# EAGLE design PCBSPI (EAGLE 9.5.1)
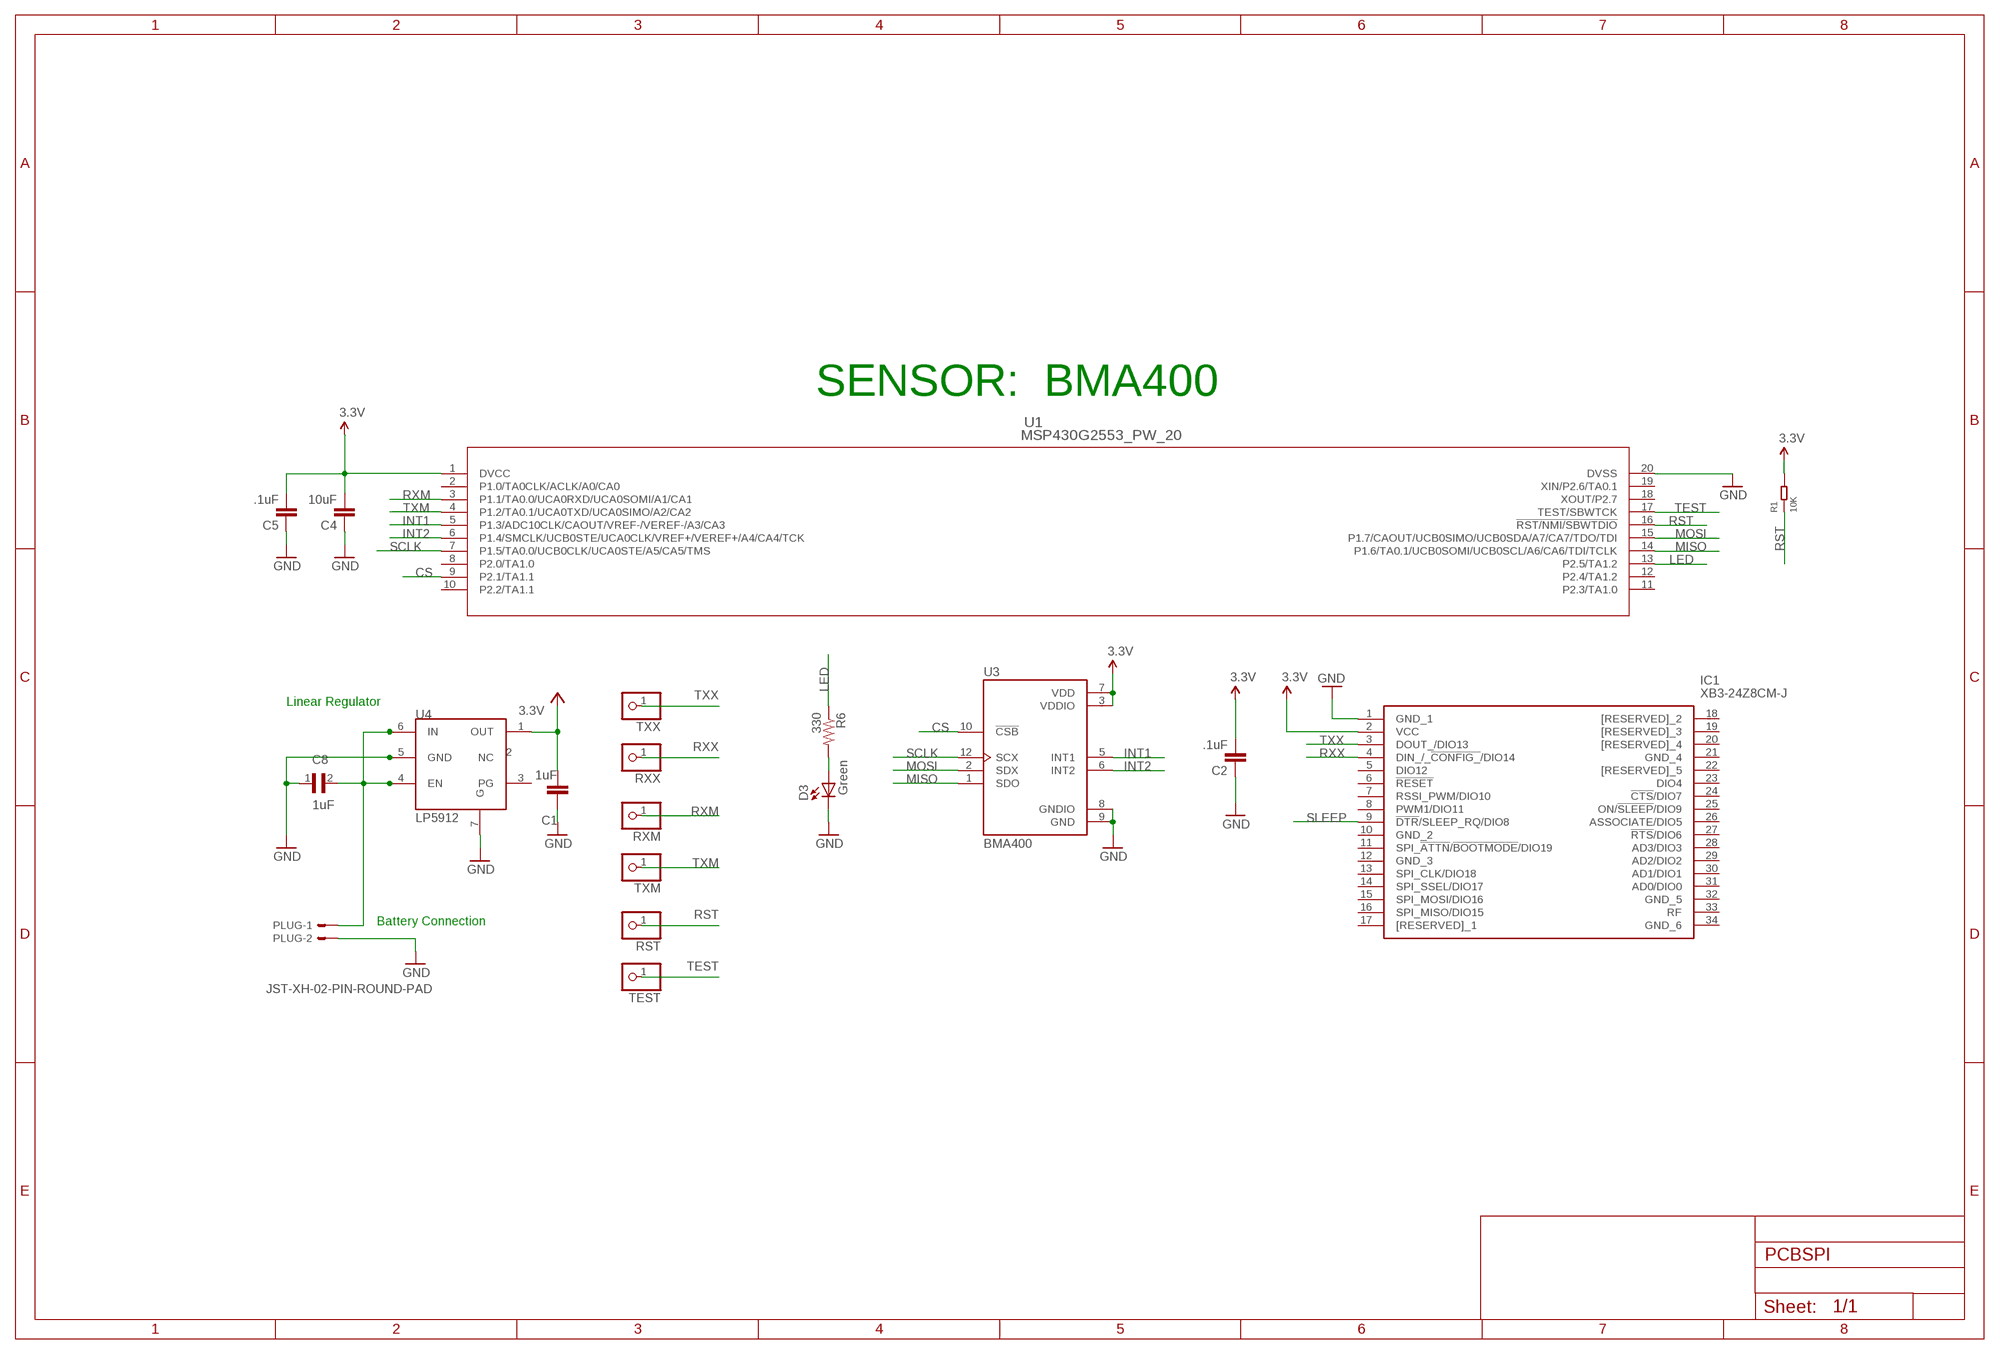
[diagram p0: schematic, sheet 1]

## Parts
C1  1uF  C-EUC0603  [C0603]
C2  .1uF  0.1UF-25V(+80/-20%)(0603)  [0603-CAP]
C4  10uF  0.1UF-25V(+80/-20%)(0603)  [0603-CAP]
C5  .1uF  0.1UF-25V(+80/-20%)(0603)  [0603-CAP]
C8  1uF  0402YD105MAT2A  [CAPC1005X71N]
D3  Green  LED  [0603-LED-ALT1]
IC1  XB3-24Z8CM-J  [XB324Z8CMJ]
PLUG  JST-XH-02-PIN-ROUND-PAD  [JST-XH-02-PACKAGE-ROUND-PAD]
R1  10K  SMD-RES-4.7K-5%-1/16W(0402)  [R0402]
R6  330  RESISTOR0603-RES  [0603-RES]
RST  PINHD-1X1  [1X01]
RXM  PINHD-1X1  [1X01]
RXX  PINHD-1X1  [1X01]
TEST  PINHD-1X1  [1X01]
TXM  PINHD-1X1  [1X01]
TXX  PINHD-1X1  [1X01]
U1  MSP430G2553_PW_20  [PW20]
U3  BMA400  [XDCR_BMA400]
U4  LP5912  [LP5912]

## Nets
3.3V: C2.2 C4.2 C5.2 IC1.2(VCC) R1.2 U1.1(DVCC) U3.3(VDDIO) U3.7(VDD)
BATTERY: C8.2 PLUG.1 U4.4(EN) U4.6(IN)
CS: U1.9(P2.1/TA1.1) U3.10(!CSB)
GND [vcc]: C1.1 C2.1 C4.1 C5.1 C8.1 D3.C IC1.1(GND_1) PLUG.2 U1.20(DVSS) U3.8(GNDIO) U3.9(GND) U4.5(GND) U4.7(G)
INT1: U1.5(P1.3/ADC10CLK/CAOUT/VREF-/VEREF-/A3/CA3) U3.5(INT1)
INT2: U1.6(P1.4/SMCLK/UCB0STE/UCA0CLK/VREF+/VEREF+/A4/CA4/TCK) U3.6(INT2)
LED: R6.1 U1.13(P2.5/TA1.2)
MISO: U1.14(P1.6/TA0.1/UCB0SOMI/UCB0SCL/A6/CA6/TDI/TCLK) U3.1(SDO)
MOSI: U1.15(P1.7/CAOUT/UCB0SIMO/UCB0SDA/A7/CA7/TDO/TDI) U3.2(SDX)
N$7: D3.A R6.2
RST: R1.1 RST.1 U1.16(!RST/NMI/SBWTDIO)
RXM: RXM.1 U1.3(P1.1/TA0.0/UCA0RXD/UCA0SOMI/A1/CA1)
RXX: IC1.4(DIN_/_!CONFIG_!/DIO14) RXX.1
SCLK: U1.7(P1.5/TA0.0/UCB0CLK/UCA0STE/A5/CA5/TMS) U3.12(SCX)
SLEEP: IC1.9(!DTR!/SLEEP_RQ/DIO8)
TEST: TEST.1 U1.17(TEST/SBWTCK)
TXM: TXM.1 U1.4(P1.2/TA0.1/UCA0TXD/UCA0SIMO/A2/CA2)
TXX: IC1.3(DOUT_/DIO13) TXX.1
VCC: C1.2 U4.1(OUT) ; supply symbol labelled 3.3V
Unconnected: IC1.5(DIO12) IC1.6(!RESET) IC1.7(RSSI_PWM/DIO10) IC1.8(PWM1/DIO11) IC1.10(GND_2) IC1.11(SPI_!ATTN!/!BOOTMODE!/DIO19) IC1.12(GND_3) IC1.13(SPI_CLK/DIO18) IC1.14(SPI_SSEL/DIO17) IC1.15(SPI_MOSI/DIO16) IC1.16(SPI_MISO/DIO15) IC1.17([RESERVED]_1) IC1.18([RESERVED]_2) IC1.19([RESERVED]_3) IC1.20([RESERVED]_4) IC1.21(GND_4) IC1.22([RESERVED]_5) IC1.23(DIO4) IC1.24(!CTS!/DIO7) IC1.25(ON/!SLEEP!/DIO9) IC1.26(ASSOCIATE/DIO5) IC1.27(!RTS!/DIO6) IC1.28(AD3/DIO3) IC1.29(AD2/DIO2) IC1.30(AD1/DIO1) IC1.31(AD0/DIO0) IC1.32(GND_5) IC1.33(RF) IC1.34(GND_6) U1.2(P1.0/TA0CLK/ACLK/A0/CA0) U1.8(P2.0/TA1.0) U1.10(P2.2/TA1.1) U1.11(P2.3/TA1.0) U1.12(P2.4/TA1.2) U1.18(XOUT/P2.7) U1.19(XIN/P2.6/TA0.1) U4.2(NC) U4.3(PG)

## Notes on the sheet
- SENSOR:  BMA400
- Linear Regulator
- Battery Connection

## Library data of the parts
C1 = rcl:C-EU: CAPACITOR, European symbol; SPICEPREFIX: C
C2 C4 C5 = SparkFun-Capacitors:0.1UF-25V(+80/-20%)(0603): CAP-00810 Ceramic Standard decoupling cap; PROD_ID: CAP-00810; VALUE: 0.1uF
C8 = Capacitor1uF:0402YD105MAT2A: CAP 1UF 16VDC X5R 20% SMD 0402; AVAILABILITY: Unavailable; DESCRIPTION: Cap 1uf 16vdc X5r 20% Smd 0402; MF: AVX; MP: 0402YD105MAT2A; PACKAGE: 1005 AVX; PRICE: None
D3 = Testing:LED: LEDs Standard schematic elements and footprints for 5mm, 3mm, 1206, and 0603 sized LEDs. 5mm - Spark Fun Electronics SKU : COM-00529 (and others)
IC1 = XB3-24Z8CM-J:XB3-24Z8CM-J: Zigbee Modules (802.15.4) XBee3 ,2.4 Ghz ZB 3.0, Chip Ant, MMT Source: Datasheet <https://www.digi.com/resources/documentation/digidocs/pdfs/90001543.pdf>; DESCRIPTION: Zigbee Modules (802.15.4) XBee3 ,2.4 Ghz ZB 3.0, Chip Ant, MMT; HEIGHT: 4mm; MANUFACTURER_NAME: Digi International; MANUFACTURER_PART_NUMBER: XB3-24Z8CM-J; MOUSER_PART_NUMBER: 888-XB3-24Z8CM-J; MOUSER_PRICE-STOCK: https://www.mouser.com/Search/Refine.aspx?Keyword=888-XB3-24Z8CM-J
PLUG = Rembrandt Electronics - JST XH Connectors v1-0:JST-XH-02-PIN: JST XH Connector 2 Pin Wire to board connector. Pitch: 2,54 mm, (0.100") Number of pins: 2 Created by Rembrandt Electronics www.rembrandtelectronics.com
R1 = RES-4.7K-SMD-5_-1_16W_0402_:SMD-RES-4.7K-5%-1/16W(0402): 301010010; AVAILABILITY: Unavailable; DESCRIPTION: Res Thick Film 0402 4.7K Ohm 5% 0.063W_1/16W_ ?100ppm/C Molded SMD Paper T/R; MF: Yageo; MP: RC0402JR074K7L; PACKAGE: 0402 Yageo; PRICE: None
R6 = SparkFun:RESISTOR: Resistor Basic schematic elements and footprints for 0603, 1206, and PTH resistors.
RST RXM RXX TEST TXM TXX = pinhead:PINHD-1X1: PIN HEADER
U1 = MSP430G2553_PW_20:MSP430G2553_PW_20; BUILT_BY: EMA_UL_Team; MANUFACTURER: Texas Instruments; MANUFACTURER_PART_NUMBER: MSP430G2553_PW_20; VENDOR: Texas Instruments
U3 = BMA400:BMA400: Ultra low power, 12-bit digital triaxial accelerometer; AVAILABILITY: Unavailable; DESCRIPTION: Accelerometer X, Y, Z Axis ±2g, 4g, 8g, 16g 12-LGA _2x2_; MF: Bosch Sensortec; MP: BMA400; PACKAGE: LGA-12 Bosch Tools; PRICE: None
U4 = electronic-labs:LP5912

## Net classes
0 default: width 0.203 mm
1 vcc: width 0.254 mm

## Board
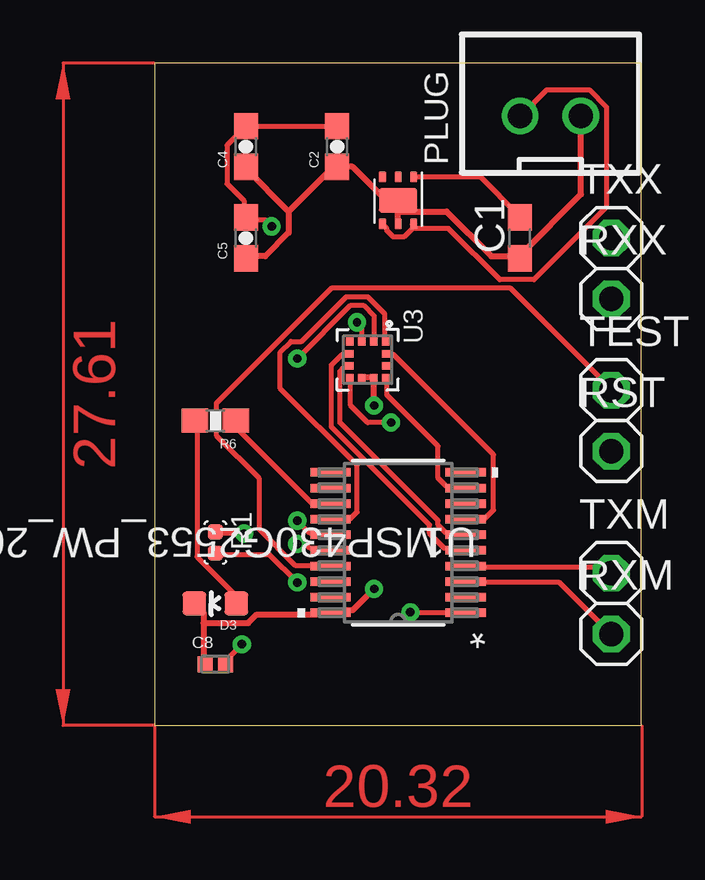
[diagram p1: board, top side]
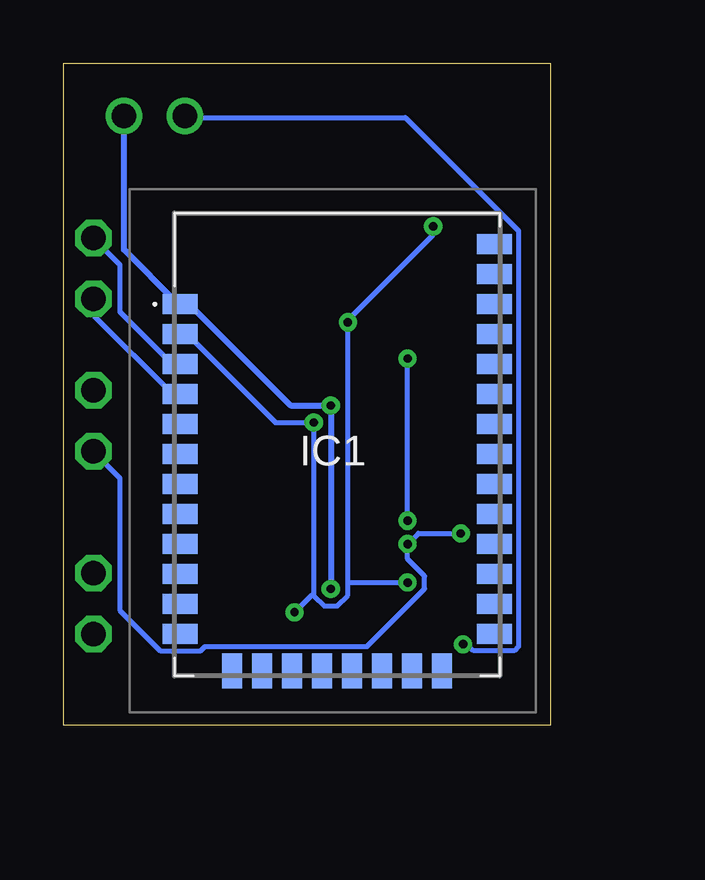
[diagram p2: board, bottom side, seen from below]

Size 20.3 x 27.61 mm. Coordinates in mm from the lower left corner, seen from the top.
Outline: 0,0 20.3,0 20.3,27.61 0,27.61 0,0
Copper layers (1*16): Top 0.035mm / dielectric 1.5mm / Bottom 0.035mm
Design rules "default": minimum track width 6mil, minimum drill 0.35mm, track to track 6mil, track to pad 6mil, pad to pad 6mil, via to via 6mil, smd to smd 6mil, copper to edge 40mil, drill to drill 6mil, minimum pad ring 10mil, minimum via ring 8mil, stop-mask expansion 4mil, vias tented up to drill 0mil, thermal gap 10mil

### Footprints (pad centres in the part's own frame; a part is rotated, then mirrored left to right if it is on the bottom)
C0603 = smd 1.1 x 1: 1 -0.85,0; 2 0.85,0
0603-CAP = smd 1.1 x 1: 1 -0.85,0; 2 0.85,0
CAPC1005X71N = smd 0.62 x 0.67: 1 -0.425,0; 2 0.425,0
0603-LED-ALT1 = smd 1 x 1: A 0,-0.877; C 0,0.877
XB324Z8CMJ = smd 1.448 x 0.838: 1 -6.553,13.75; 2 -6.553,12.5; 3 -6.553,11.25; 4 -6.553,10; 5 -6.553,8.75; 6 -6.553,7.5; 7 -6.553,6.25; 8 -6.553,5; 9 -6.553,3.75; 10 -6.553,2.5; 11 -6.553,1.25; 12 -6.553,0; 21 6.553,0; 22 6.553,1.25; 23 6.553,2.5; 24 6.553,3.75; 25 6.553,5; 26 6.553,6.25; 27 6.553,7.5; 28 6.553,8.75; 29 6.553,10; 30 6.553,11.25; 31 6.553,12.5; 32 6.553,13.75; 33 6.553,15; 34 6.553,16.25 | smd 0.838 x 1.448: 13 -4.375,-1.537; 14 -3.125,-1.537; 15 -1.875,-1.537; 16 -0.625,-1.537; 17 0.625,-1.537; 18 1.875,-1.537; 19 3.125,-1.537; 20 4.375,-1.537
JST-XH-02-PACKAGE-ROUND-PAD = drill 1.016: 1 -1.27,0; 2 1.27,0
R0402 = smd 0.635 x 0.635: 1 0,0.445; 2 0,-0.445
0603-RES = smd 1.1 x 1: 1 -0.85,0; 2 0.85,0
1X01 = drill 1.016 octagon: 1 0,0
PW20 = smd 1.676 x 0.356: 1 -2.819,2.925; 2 -2.819,2.275; 3 -2.819,1.625; 4 -2.819,0.975; 5 -2.819,0.325; 6 -2.819,-0.325; 7 -2.819,-0.975; 8 -2.819,-1.625; 9 -2.819,-2.275; 10 -2.819,-2.925; 11 2.819,-2.925; 12 2.819,-2.275; 13 2.819,-1.625; 14 2.819,-0.975; 15 2.819,-0.325; 16 2.819,0.325; 17 2.819,0.975; 18 2.819,1.625; 19 2.819,2.275; 20 2.819,2.925
XDCR_BMA400 = smd 0.35 x 0.3: 1 -0.775,0.75; 2 -0.775,0.25; 3 -0.775,-0.25; 4 -0.775,-0.75; 7 0.775,-0.75; 8 0.775,-0.25; 9 0.775,0.25; 10 0.775,0.75 | smd 0.3 x 0.35: 5 -0.25,-0.775; 6 0.25,-0.775; 11 0.25,0.775; 12 -0.25,0.775
LP5912 = smd 0.45 x 0.3: 1 0,0.65; 2 0,0; 3 0,-0.65; 4 1.95,-0.65; 5 1.95,0; 6 1.95,0.65 | smd 1 x 1.6: 7 0.975,0

### Placement (x,y rotation side)
C1  15.24,20.32 90 top
C2  7.62,24.13 90 top
C4  3.81,24.13 90 top
C5  3.81,20.32 90 top
C8  2.54,2.54 0 top
D3  2.54,5.08 90 top
IC1  8.89,3.81 0 bottom
PLUG  16.51,25.4 0 top
R1  2.54,7.62 0 top
R6  2.54,12.7 180 top
RST  19.05,11.43 0 top
RXM  19.05,3.81 0 top
RXX  19.05,17.78 0 top
TEST  19.05,13.97 0 top
TXM  19.05,6.35 0 top
TXX  19.05,20.32 0 top
U1  10.16,7.62 180 top
U3  8.89,15.24 270 top
U4  10.16,22.86 270 top

### Tracks (layer width: path | path; a pad name or v marks a point on that pad's centre or on a via)
3.3V  (via drill 0.35)
  Top 0.203: C2.2 7.56,24.98 3.91,24.98 C4.2 3.73,24.89 3.02,24.18 3.02,22.58 3.73,21.87 3.73,21.25 C5.2 3.82,21.07 4.62,21.07 v4.89,20.8 | v9.87,12.62 8.89,12.62 8.18,13.34 8.18,14.4 U3.7 | v8.45,16.8 8.62,16.62 8.62,16.09 U3.3 | v5.96,5.96 4.8,7.11 2.58,7.11 R1.2 | v10.67,4.71 12.98,4.71 U1.1
  Bottom 0.203: IC1.2 15.38,16.27 15.11,16.27 11.47,12.62 v9.87,12.62 9.87,5.42 | 8.45,5.96 8.45,5.42 8.89,4.98 9.42,4.98 9.87,5.42 | 8.45,5.96 v8.45,16.8 8.45,16.89 4.89,20.45 v4.89,20.8 | 8.45,5.96 v5.96,5.96 | v10.67,4.71 9.96,5.42 9.87,5.42
BATTERY  (via drill 0.35)
  Top 0.203: U4.4 9.51,20.89 9.69,20.71 9.69,20.62 9.96,20.36 10.4,20.36 10.76,20.71 10.76,20.89 U4.6 10.85,20.71 12.27,20.71 14.4,18.58 15.82,18.58 18.85,21.6 18.85,25.78 18.14,26.49 16.36,26.49 15.29,25.43 PLUG.1 | v3.65,3.38 3.02,2.76 3.02,2.58 C8.2
  Bottom 0.203: v3.65,3.38 3.47,3.38 3.2,3.11 1.51,3.11 1.33,3.29 1.33,20.62 6.04,25.34 15.2,25.34 PLUG.1
CS
  Top 0.203: U3.10 9.69,14.4 9.69,13.78 11.82,11.65 11.82,10.31 12.18,9.96 12.98,9.96 U1.9
GND  (via drill 0.35)
  Top 0.254: 5.6,21.43 5.6,20.54 4.62,19.56 3.82,19.56 C5.1 | 5.6,21.43 3.82,23.2 C4.1 | 5.6,21.43 7.38,23.2 7.56,23.2 C2.1 7.73,23.29 8.27,23.29 9.6,21.96 10.05,21.96 U4.7 | U4.5 10.13,20.98 10.13,21.87 U4.7 | U4.7 10.22,21.43 12.18,21.43 14.05,19.56 15.2,19.56 C1.1 15.29,19.65 17.78,22.14 PLUG.2 | 2.04,4.27 2.04,4.71 1.69,5.07 D3.C | 2.04,4.27 2.04,2.58 C8.1 | 2.04,4.27 3.91,4.27 4.27,4.62 7.29,4.62 U1.20 7.38,4.8 8.27,4.8 v9.16,5.69 | U3.8 8.71,14.49 9.07,14.49 U3.9 9.16,14.4 v9.16,13.34
  Bottom 0.254: v9.16,5.69 v9.16,13.34 10.85,13.34 15.02,17.51 15.38,17.51 IC1.1 15.56,17.6 17.78,19.82 PLUG.2
INT1
  Top 0.203: U3.5 8.09,15.47 7.82,15.47 7.38,15.02 7.38,12.45 11.47,8.36 11.47,8 12.09,7.38 12.98,7.38 U1.5
INT2
  Top 0.203: U3.6 8.09,14.94 7.91,14.94 7.73,14.76 7.73,12.62 11.82,8.53 11.82,8.36 12.18,8 12.98,8 U1.6
LED
  Top 0.203: R6.1 3.47,12.62 3.47,12.36 6.58,9.25 7.29,9.25 U1.13
MISO
  Top 0.203: U3.1 9.6,16.09 9.6,17.16 8.89,17.87 8,17.87 6.13,16 5.69,16 5.25,15.56 5.25,14.05 8.45,10.85 8.45,8.89 8.18,8.62 7.38,8.62 U1.14
MOSI  (via drill 0.35)
  Top 0.203: v5.96,15.29 8.18,17.51 8.71,17.51 9.16,17.07 9.16,16.09 U3.2 | v5.96,8.53 6.49,8 7.29,8 U1.15
  Bottom 0.203: v5.96,8.53 v5.96,15.29
N$7
  Top 0.203: D3.A 3.38,5.16 3.38,5.42 1.78,7.02 1.78,12.62 R6.2
RST  (via drill 0.35)
  Top 0.203: v3.73,8 2.58,8 R1.1 | v5.96,7.56 6.31,7.56 6.49,7.38 7.29,7.38 U1.16
  Bottom 0.203: v3.73,8 5.51,8 v5.96,7.56 5.96,6.93 5.25,6.22 5.25,5.69 7.64,3.29 14.4,3.29 14.58,3.11 16.27,3.11 17.96,4.8 17.96,10.31 19.02,11.38 RST.1
RXM
  Top 0.203: U1.3 12.98,5.96 16.89,5.96 19.02,3.82 RXM.1
RXX
  Bottom 0.203: IC1.4 15.47,13.87 15.82,13.87 19.02,17.07 19.02,17.78 RXX.1
SCLK
  Top 0.203: U3.12 9.69,15.47 9.96,15.47 14.13,11.29 14.13,8.98 13.78,8.62 12.98,8.62 U1.7
TEST
  Top 0.203: U1.17 7.29,6.67 5.87,6.67 4.36,8.18 4.36,10.31 2.58,12.09 2.58,13.42 7.38,18.22 14.85,18.22 19.02,14.05 TEST.1
TXM
  Top 0.203: U1.4 12.98,6.58 18.85,6.58 19.02,6.4 TXM.1
TXX
  Bottom 0.203: IC1.3 15.47,15.11 15.82,15.11 17.96,17.25 17.96,19.2 19.02,20.27 TXX.1
VCC
  Top 0.203: U4.1 10.85,22.85 13.6,22.85 15.2,21.25 C1.2
(copper drawn outside any net)
  shapes: Top area x2